# EAGLE design pad (EAGLE 6.5.0)
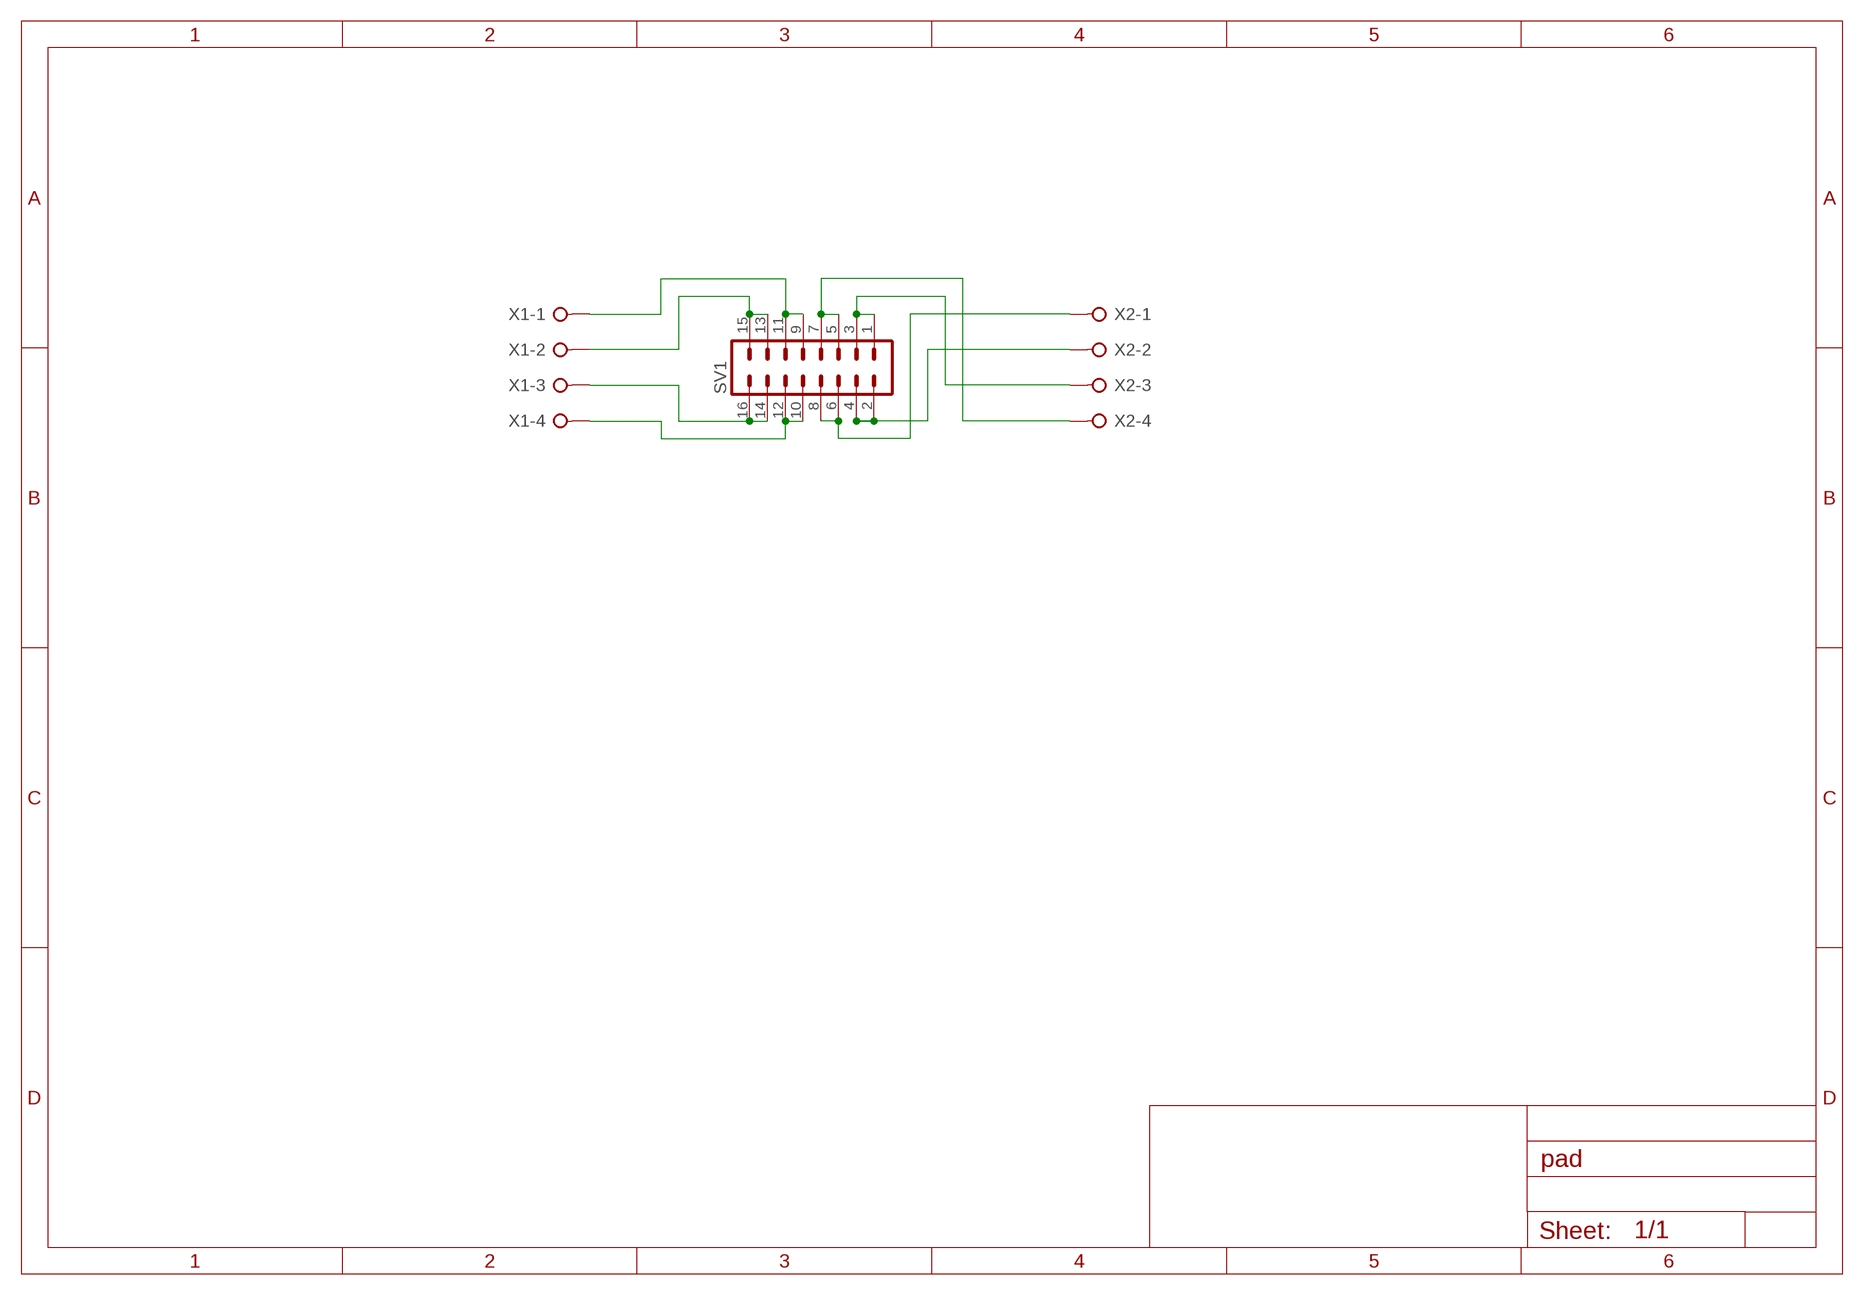
[diagram p0: schematic, sheet 1]

## Parts
SV1  MA08-2  [MA08-2]
X1  W237-04P  [W237-4P]
X2  W237-04P  [W237-4P]

## Nets
IN1: SV1.9 SV1.11 X1.1
IN2: SV1.13 SV1.15 X1.2
IN3: SV1.14 SV1.16 X1.3
IN4: SV1.10 SV1.12 X1.4
OUT1: SV1.6 SV1.8 X2.1
OUT2: SV1.2 SV1.4 X2.2
OUT3: SV1.1 SV1.3 X2.3
OUT4: SV1.5 SV1.7 X2.4

## Library data of the parts
SV1 = con-lstb:MA08-2: PIN HEADER; OC_FARNELL: unknown; OC_NEWARK: unknown
X1 X2 = con-wago-508:W237-04P: WAGO SREW CLAMP; OC_FARNELL: unknown; OC_NEWARK: unknown

## Board
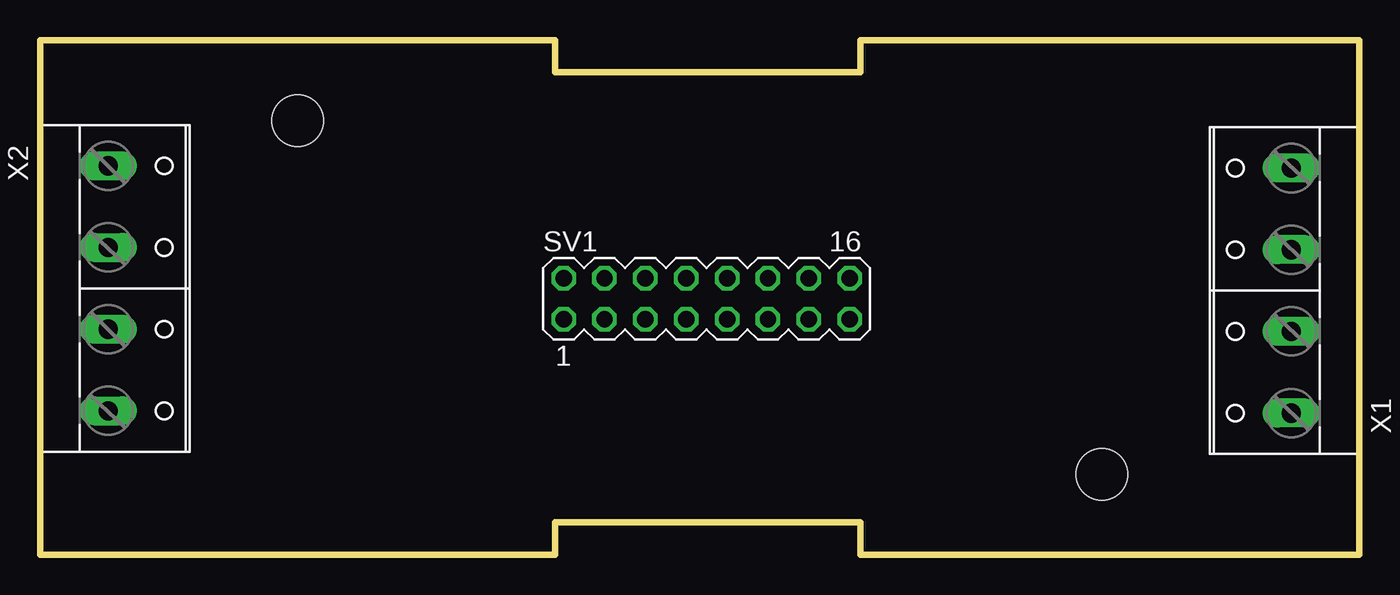
[diagram p1: board, top side]
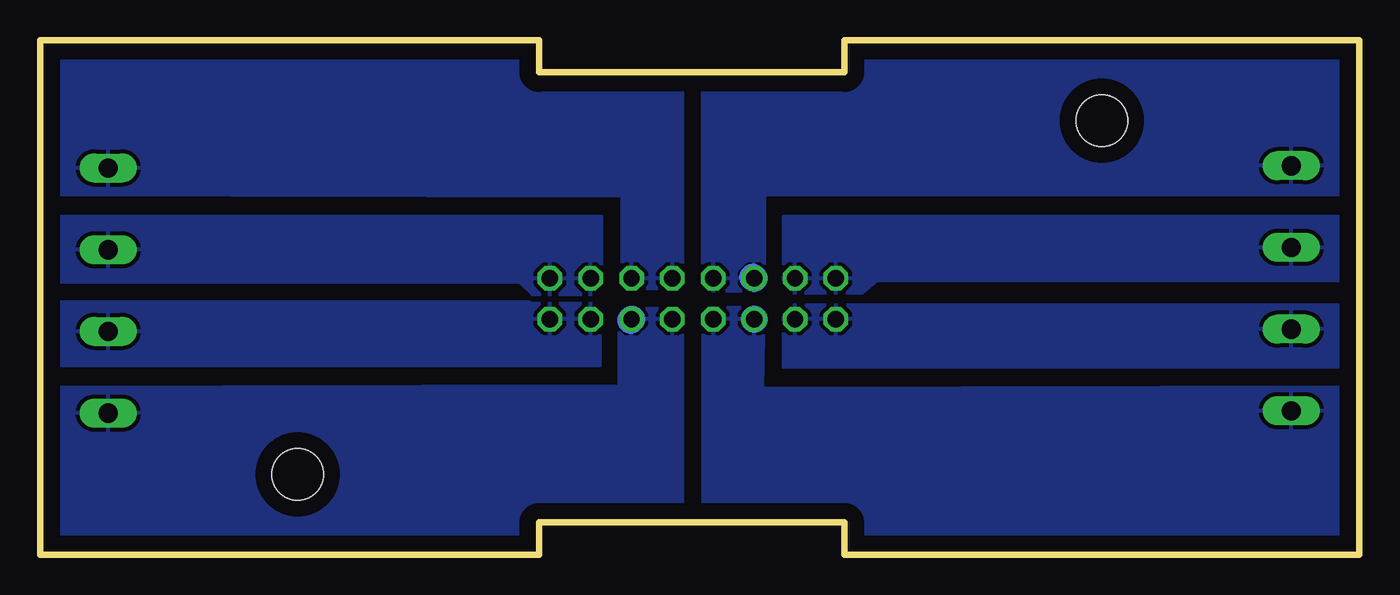
[diagram p2: board, bottom side, seen from below]

Size 82 x 32 mm. Coordinates in mm from the lower left corner, seen from the top.
Outline: 0,32 32,32 32,30 51,30 51,32 82,32 82,0 51,0 51,2 32,2 32,0 0,0 0,32
Copper layers (1*16): Top 0.035mm / dielectric 1.5mm / Bottom 0.035mm
Design rules "default": minimum track width 10mil, minimum drill 24mil, track to track 8mil, track to pad 8mil, pad to pad 8mil, via to via 8mil, smd to smd 8mil, copper to edge 40mil, drill to drill 8mil, minimum pad ring 10mil, minimum via ring 8mil, stop-mask expansion 4mil, vias tented up to drill 0mil, thermal gap 10mil
Holes 3.2 mm at 16,27 66,5

### Footprints (pad centres in the part's own frame; a part is rotated, then mirrored left to right if it is on the bottom)
MA08-2 = drill 1.016 octagon: 1 -8.89,-1.27; 2 -8.89,1.27; 3 -6.35,-1.27; 4 -6.35,1.27; 5 -3.81,-1.27; 6 -3.81,1.27; 7 -1.27,-1.27; 8 -1.27,1.27; 9 1.27,-1.27; 10 1.27,1.27; 11 3.81,-1.27; 12 3.81,1.27; 13 6.35,-1.27; 14 6.35,1.27; 15 8.89,-1.27; 16 8.89,1.27
W237-4P = drill 1.194 long: 1 -7.62,-0.635; 2 -2.54,-0.635; 3 2.54,-0.635; 4 7.62,-0.635

### Placement (x,y rotation side)
SV1  41.43,15.92 0 top
X1  77.14,16.43 90 top
X2  4.86,16.57 270 top

### Tracks (layer width: path | path; a pad name or v marks a point on that pad's centre or on a via)
IN1
  Bottom 1.676: 45.3,14.59 SV1.11
  pour Bottom: 42.1,15.3 42.1,0 83,0 83,10.4 46,10.5 46,15.3
IN2
  pour Bottom: 47.2,15.6 51.5,15.6 51.6,15.7 82.1,15.7 82.1,11.8 47.2,11.8
IN3
  pour Bottom: 47.1,21 82,21 82,17 52.2,17 51.4,16.2 47.1,16.2
IN4
  pour Bottom: 42.1,32 42.1,16.6 45.8,16.5 45.8,22.3 82.3,22.4 82.4,22.5 82.3,32.1 82.2,32.2 42,32.2
OUT1
  Bottom 1.676: 37.7,17.27 SV1.6
  pour Bottom: 0,32 0,22.4 37,22.4 37,16.8 37.5,16.4 40.8,16.4 40.8,31.8 41,32
OUT2
  pour Bottom: 0,21 35.8,21 35.8,16.3 30.9,16.3 30,17.1 0,17.1
OUT3
  pour Bottom: 0.1,15.5 35.8,15.5 35.8,11.7 0.1,11.7
OUT4
  Bottom 1.676: 37.6,14.63 SV1.5
  pour Bottom: 0,10.4 37.1,10.3 37,15.4 40.8,15.3 40.8,-0.1 0,0